# EAGLE design V4.0.1 Embutida (EAGLE 9.6.2)
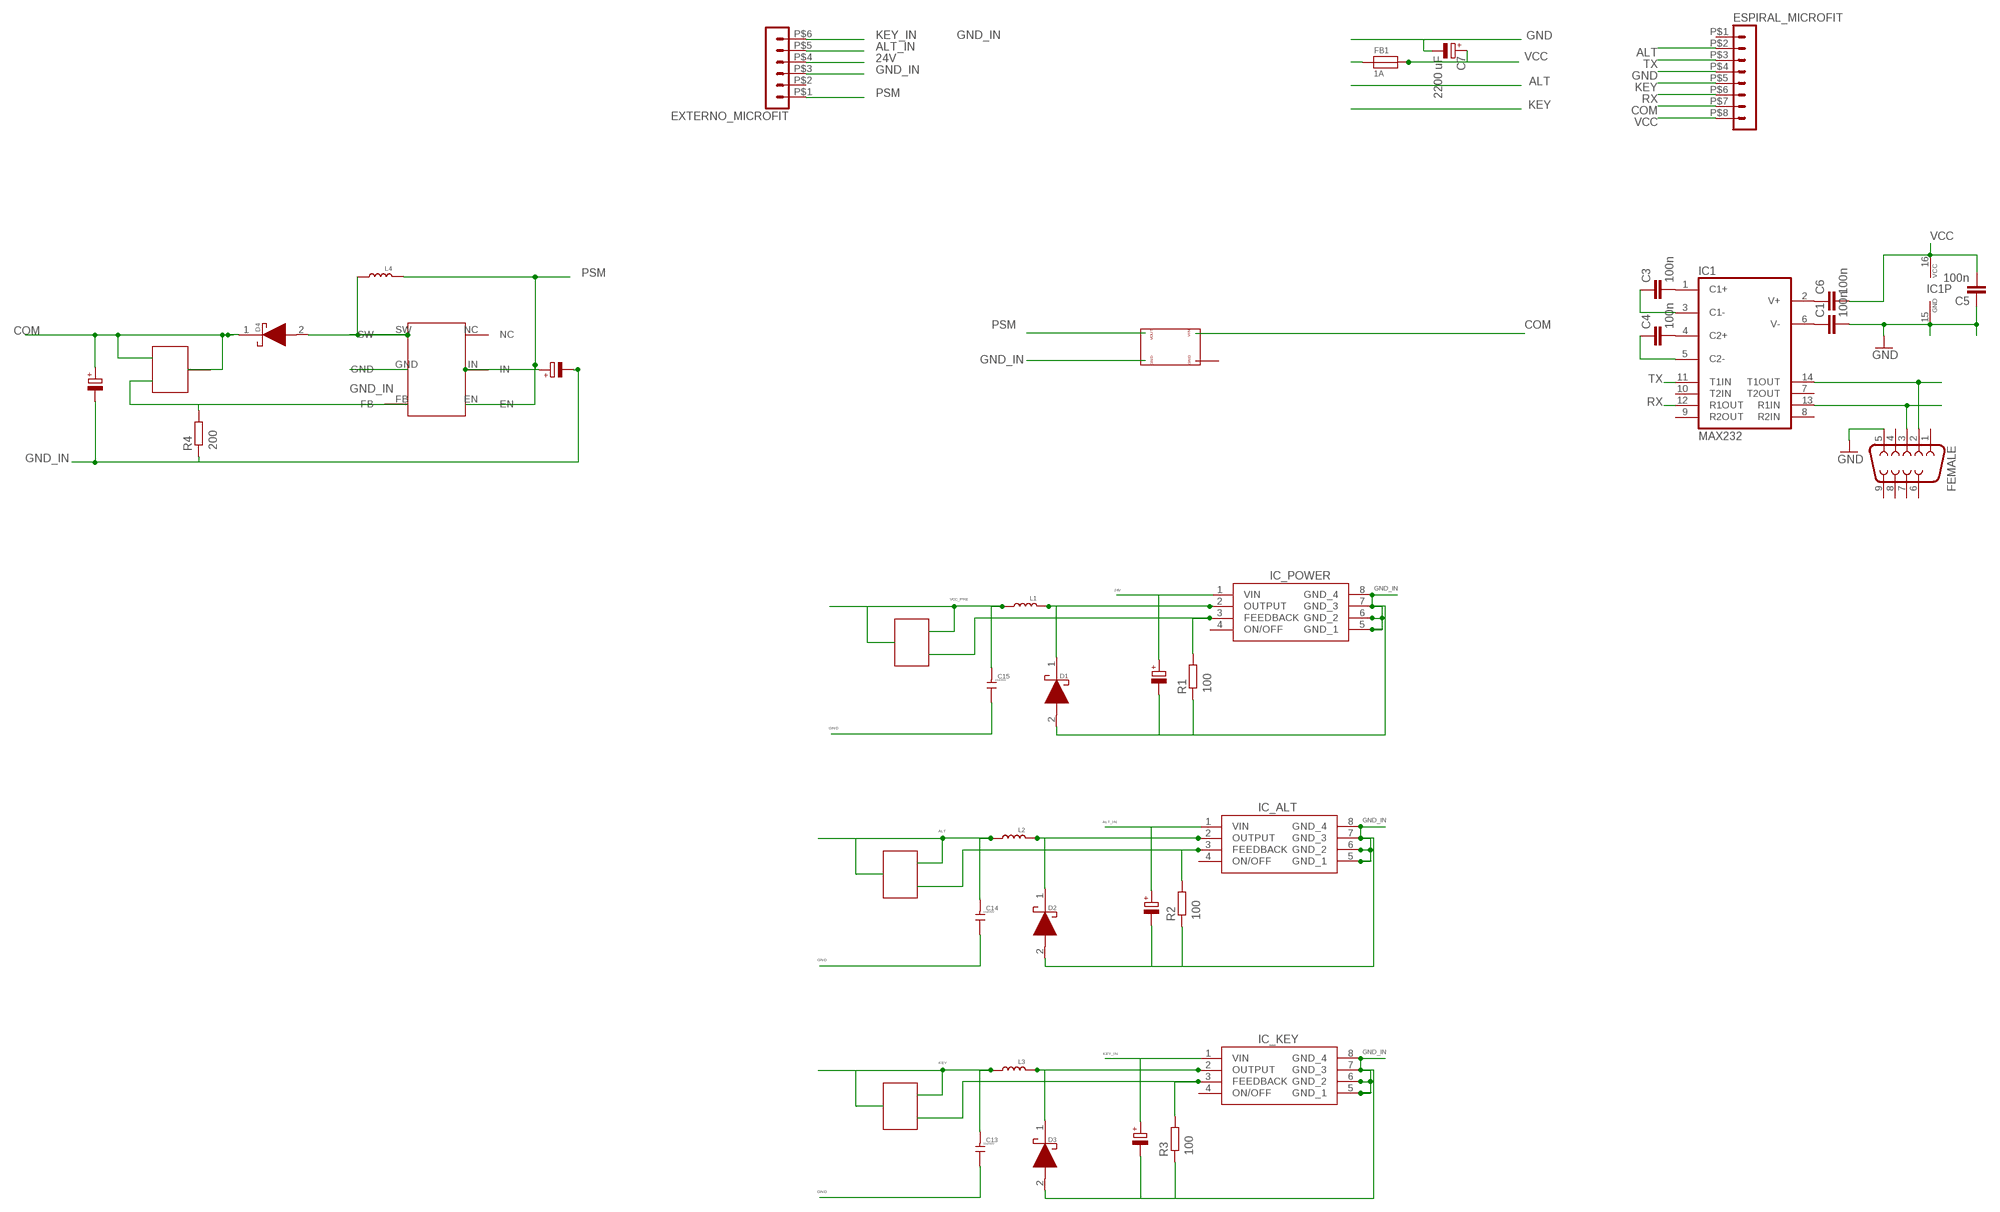
[diagram p0: schematic, sheet 1]

## Parts
C1  100n  C-EUC0805  [C0805]
C2  22uF/50v  CPOL-EUD  [PANASONIC_D]
C3  100n  C-EUC0805  [C0805]
C4  100n  C-EUC0805  [C0805]
C5  100n  C-EUC0805  [C0805]
C6  100n  C-EUC0805  [C0805]
C7  2200 uF  CPOL-EUD  [PANASONIC_D]
C8  22uF/50V  CPOL-EUD  [PANASONIC_D]
C9  22uF/50V  CPOL-EUD  [PANASONIC_D]
C13  10uF/50V  C-0805  [C0805]
C14  10uF/50V  C-0805  [C0805]
C15  10uF/50V  C-0805  [C0805]
C18  22uF/50v  CPOL-EUD  [PANASONIC_D]
C19  22uF/50v  CPOL-EUD  [PANASONIC_D]
D1  1N5819HW1-7-F  [SODFL3518X115N]
D2  1N5819HW1-7-F  [SODFL3518X115N]
D3  1N5819HW1-7-F  [SODFL3518X115N]
D4  1N5819HW1-7-F  [SODFL3518X115N]
ESPIRAL_MICROFIT  HEADER_POS8_43045-0800  [43045-0800]
EXTERNO_MICROFIT  HEADER_POS6_43045-0600  [43045-0600]
FB1  1A  FERRITE0805  [0805]
FEMALE  F09H  [F09H]
IC1  MAX232  MAX232ECWES  [SO16]
IC_ALT  XL1509-3.3E1  [SOIC127P600X175-8N]
IC_KEY  XL1509-3.3E1  [SOIC127P600X175-8N]
IC_POWER  XL1509-3.3E1  [SOIC127P600X175-8N]
IC_UP  SDB628  [SDB628]
L1  47uH  L'PIO73'  [PIO73]
L2  47uH  L'PIO73'  [PIO73]
L3  47uH  L'PIO73'  [PIO73]
L4  4.7uH  L'PIO73'  [PIO73]
R1  100  R-EU_R0805  [R0805]
R2  100  R-EU_R0805  [R0805]
R3  100  R-EU_R0805  [R0805]
R4  200  R-EU_R0805  [R0805]
STEP_UP  STEP-UP  [STEP-UP]
T1  TRIMPOT 10K  TRIMPOT  [TRIMPOT]
T2  TRIMPOT 10K  TRIMPOT  [TRIMPOT]
T3  TRIMPOT 10K  TRIMPOT  [TRIMPOT]
T4  TRIMPOT 10K  TRIMPOT  [TRIMPOT]

## Nets
24V: C2.+ EXTERNO_MICROFIT.P$4 IC_POWER.1(VIN)
ALT: C14.2 ESPIRAL_MICROFIT.P$2 L2.2 T2.VCC1 T2.VCC2
ALT_IN: C8.+ EXTERNO_MICROFIT.P$5 IC_ALT.1(VIN)
COM: C18.+ D4.1(K) ESPIRAL_MICROFIT.P$7 STEP_UP.VIN T4.VCC1 T4.VCC2
GND: C1.2 C5.1 C7.- C13.1 C14.1 C15.1 ESPIRAL_MICROFIT.P$4 FEMALE.5 IC1.15(GND)
GND_IN: C2.- C8.- C9.- C18.- C19.- D1.2(A) D2.2(A) D3.2(A) EXTERNO_MICROFIT.P$3 IC_ALT.5(GND_1) IC_ALT.6(GND_2) IC_ALT.7(GND_3) IC_ALT.8(GND_4) IC_KEY.5(GND_1) IC_KEY.6(GND_2) IC_KEY.7(GND_3) IC_KEY.8(GND_4) IC_POWER.5(GND_1) IC_POWER.6(GND_2) IC_POWER.7(GND_3) IC_POWER.8(GND_4) IC_UP.GND R1.1 R2.1 R3.1 R4.1 STEP_UP.GND_OUT
KEY: C13.2 ESPIRAL_MICROFIT.P$5 L3.2 T3.VCC1 T3.VCC2
KEY_IN: C9.+ EXTERNO_MICROFIT.P$6 IC_KEY.1(VIN)
N$1: D1.1(K) IC_POWER.2(OUTPUT) L1.1
N$2: D2.1(K) IC_ALT.2(OUTPUT) L2.1
N$3: D4.2(A) IC_UP.SW L4.2
N$4: IC_ALT.3(FEEDBACK) R2.2 T2.OUT
N$5: D3.1(K) IC_KEY.2(OUTPUT) L3.1
N$6: IC_KEY.3(FEEDBACK) R3.2 T3.OUT
N$7: IC_UP.FB R4.2 T4.OUT
N$8: IC_POWER.3(FEEDBACK) R1.2 T1.OUT
N$11: C3.2 IC1.1(C1+)
N$12: C4.2 IC1.4(C2+)
N$13: C3.1 IC1.3(C1-)
N$17: C4.1 IC1.5(C2-)
N$18: C6.1 IC1.2(V+)
N$19: C1.1 IC1.6(V-)
N$20: FEMALE.2 IC1.14(T1OUT)
N$30: FEMALE.3 IC1.13(R1IN)
PSM: C19.+ EXTERNO_MICROFIT.P$1 IC_UP.EN IC_UP.IN L4.1 STEP_UP.VOUT(OUT)
RX: ESPIRAL_MICROFIT.P$6 IC1.12(R1OUT)
TX: ESPIRAL_MICROFIT.P$3 IC1.11(T1IN)
VCC: C5.2 C6.2 C7.+ ESPIRAL_MICROFIT.P$8 FB1.2 IC1.16(VCC)
VCC_PRE: C15.2 FB1.1 L1.2 T1.VCC1 T1.VCC2
Unconnected: ESPIRAL_MICROFIT.P$1 EXTERNO_MICROFIT.P$2 FEMALE.1 FEMALE.4 FEMALE.6 FEMALE.7 FEMALE.8 FEMALE.9 IC1.7(T2OUT) IC1.8(R2IN) IC1.9(R2OUT) IC1.10(T2IN) IC_ALT.4(ON/OFF) IC_KEY.4(ON/OFF) IC_POWER.4(ON/OFF) IC_UP.NC STEP_UP.GND_IN

## Library data of the parts
C1 C3-C6 = rcl@1:C-EU: CAPACITOR, European symbol; MPN: C0805C104K8RACAUTO
C2 C8 C9 C18 C19 = rcl:CPOL-EU: POLARIZED CAPACITOR, European symbol; MPN: EEH-ZA1H220P; SPICEPREFIX: C
C7 = rcl:CPOL-EU: POLARIZED CAPACITOR, European symbol; MPN: EEV-FK1A222Q; SPICEPREFIX: C
C13-C15 = discrete:C*: Ceramic Capacitors; MPN: C2012X5R1H106K125AC
D1-D4 = 1N5819HW1-7-F:1N5819HW1-7-F: 1N5819 Schottky Diode 40V 1A SOD123F Source: Datasheet <https://www.diodes.com/assets/Datasheets/1N5819HW1.pdf>; ARROW_PART_NUMBER: 1N5819HW1-7-F; ARROW_PRICE-STOCK: https://www.arrow.com/en/products/1n5819hw1-7-f/diodes-incorporated?region=nac; DESCRIPTION: 1N5819 Schottky Diode 40V 1A SOD123F; HEIGHT: 1.15mm; MANUFACTURER_NAME: Diodes Inc.; MANUFACTURER_PART_NUMBER: 1N5819HW1-7-F; MOUSER_PART_NUMBER: 621-1N5819HW1-7-F; MOUSER_PRICE-STOCK: https://www.mouser.co.uk/ProductDetail/Diodes-Incorporated/1N5819HW1-7-F?qs=60RJRzIpcl9ACQG7Zn63jQ%3D%3D; MPN: 1N5822 SS34
ESPIRAL_MICROFIT = con-molex-micro-fit-3_0 (1):HEADER_POS8_?: Molex - Micro-Fit 3.0 Series connector, 3.00mm (0.118") pitch header, 8 positions.; MPN: 43045-0800
EXTERNO_MICROFIT = con-molex-micro-fit-3_0 (1):HEADER_POS6_?: Molex - Micro-Fit 3.0 Series connector, 3.00mm (0.118") pitch header, 6 positions.; MPN: 43045-0600
FB1 = microbuilder:FERRITE: Ferrite Bead 0603 MMZ1608B121C - 120 Ohm, 600mA Ferrite Chip - Digikey: 445-2164-1-ND BK1608HW121-T - 120 Ohm, 600mA Ferrite Chip - Digikey: 587-1876-2-ND 0805 HZ0805B272R-10 - 2.7K Ohm @ 100MHz, 200mA 0.8 Ohm DC Resistance - Digikey: 240-2504-1-ND (see also Murata BLM21BD272SN1L); MPN: BLM21AG121SN1D
FEMALE = con-subd:F09: SUB-D; MPN: FEMALE DR9; OC_FARNELL: unknown; OC_NEWARK: unknown
IC1 = maxim-6b:MAX232ECWE: RS232 TRANSEIVER; MPN: MAX3232CSE+
IC_ALT IC_KEY IC_POWER = XL1509-3.3E1:XL1509-3.3E1: 40V 2A SOP-8_150mil DC-DC Converters RoHS Source: Datasheet <https://datasheet.lcsc.com/szlcsc/XLSEMI-XL1509-3-3E1_C74193.pdf>; DESCRIPTION: 40V 2A SOP-8_150mil DC-DC Converters RoHS; HEIGHT: 1.75mm; MANUFACTURER_NAME: XLSEMI; MANUFACTURER_PART_NUMBER: XL1509-3.3E1; MPN: XL1509-ADJE1
IC_UP = SDB628:SDB628; MPN: SDB628
L1-L3 = discrete:L*; MPN: SDE0604A-470M
L4 = discrete:L*; MPN: DR74-4R7-R
R1-R3 = rcl:R-EU_: RESISTOR, European symbol; MPN: RA73F2A100RBTDF; SPICEPREFIX: R
R4 = rcl:R-EU_: RESISTOR, European symbol; MPN: CRCW0805200RJNEAIF; SPICEPREFIX: R
STEP_UP = Step Up:STEP-UP; MPN: SX1308
T1-T4 = TRIMPOT:TRIMPOT; MPN: EVM3ESX50B14

## Module LDR
Ports: 

### Library data of the parts

## Net classes
1 New Class: width 0.5 mm, drill 1 mm

## Board
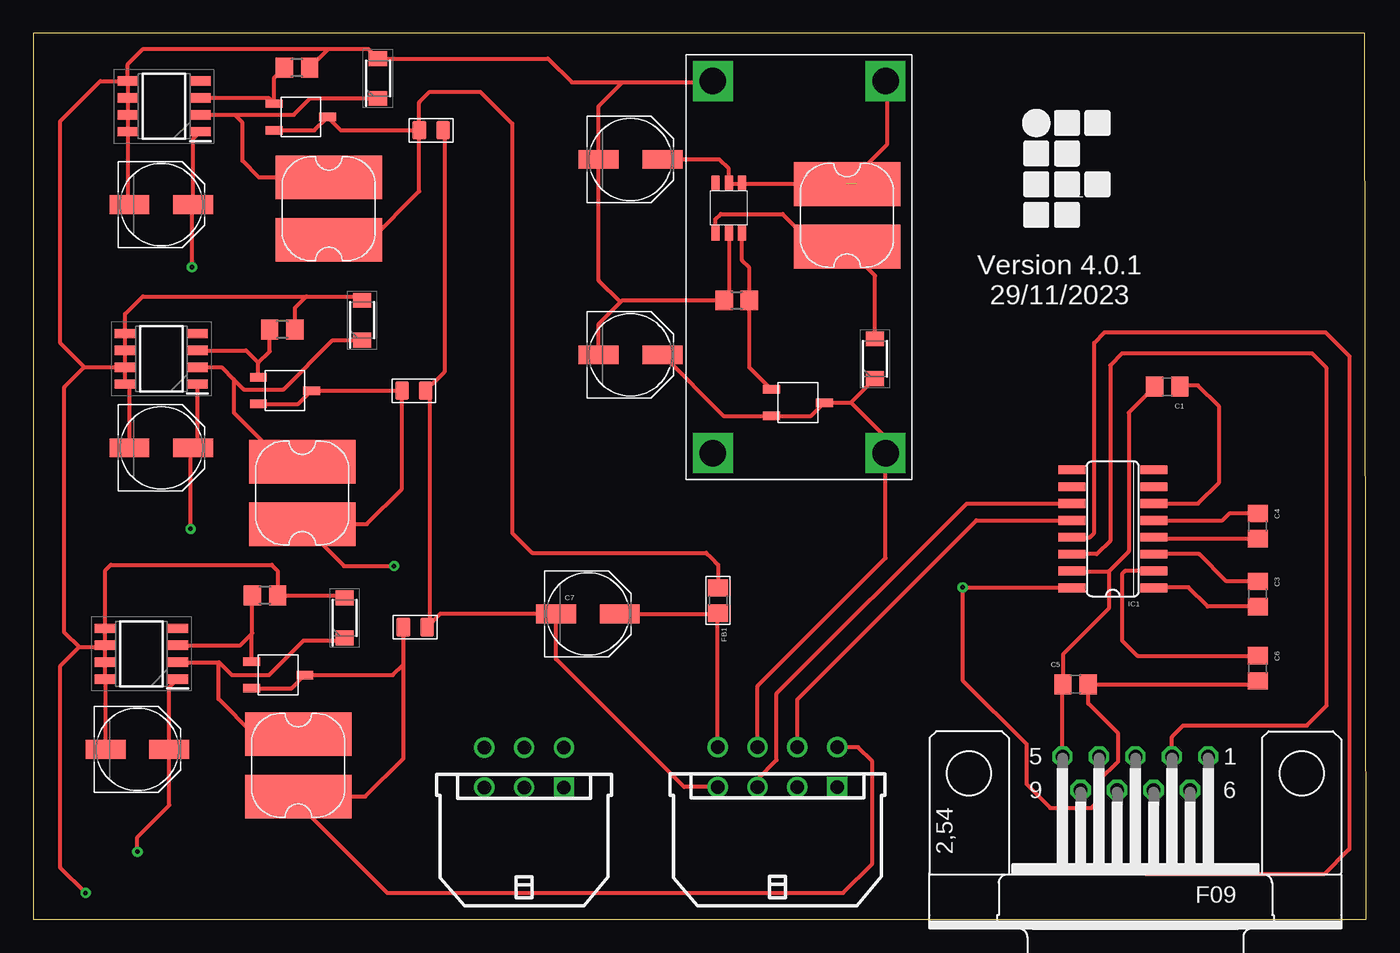
[diagram p1: board, top side]
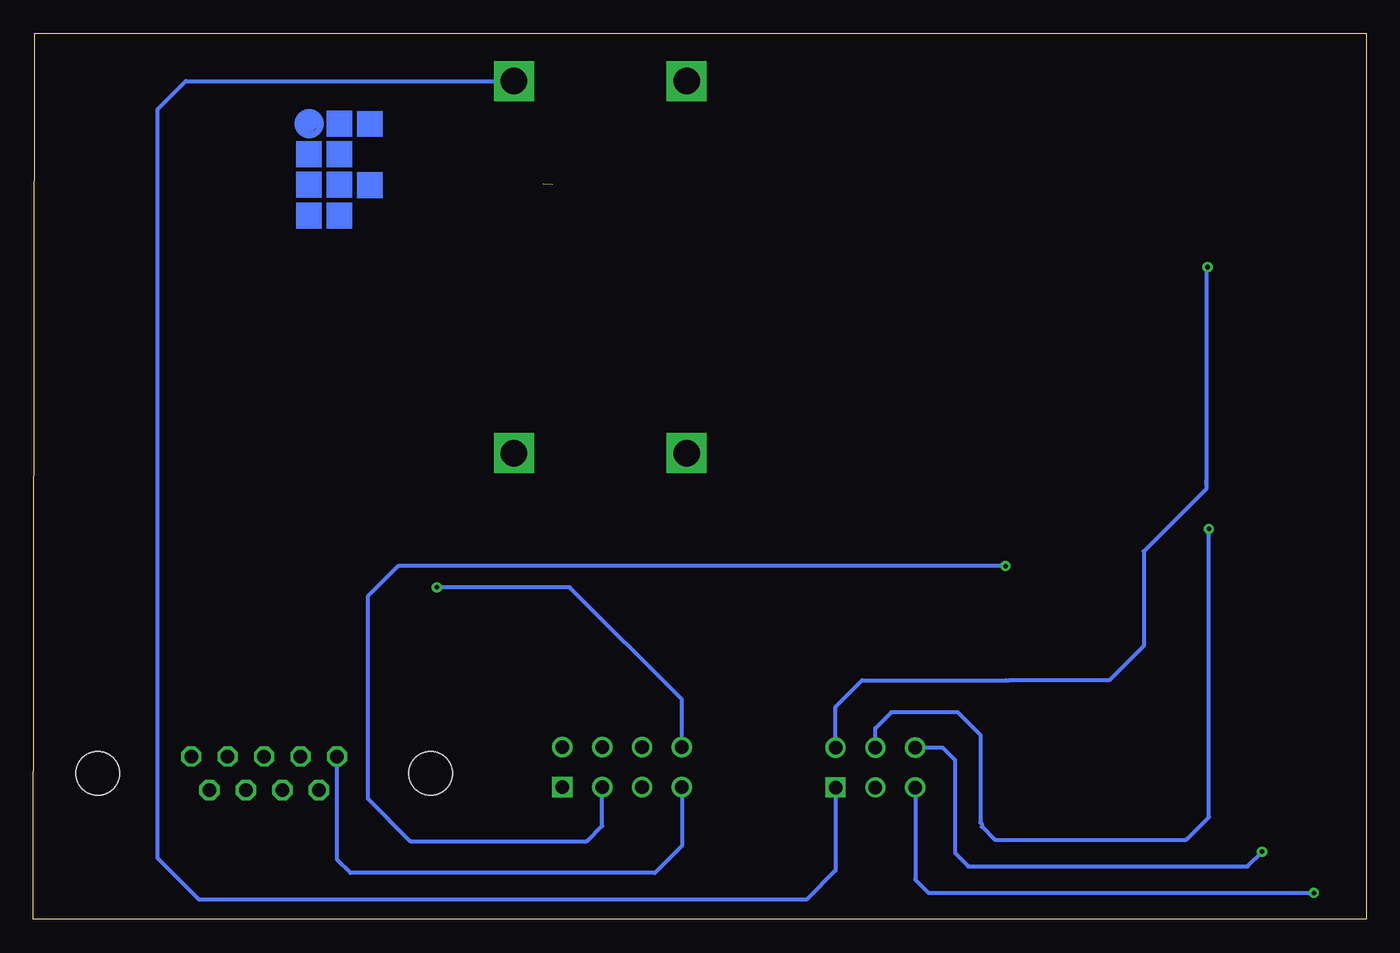
[diagram p2: board, bottom side, seen from below]

Size 100.32 x 66.7 mm. Coordinates in mm from the lower left corner, seen from the top.
Outline: 0,0 100.32,0 100.2,66.7 0,66.7 0,0
Copper layers (1*16): Top 0.035mm / dielectric 1.5mm / Bottom 0.035mm
Design rules "default *": minimum track width 6mil, minimum drill 0.35mm, track to track 6mil, track to pad 6mil, pad to pad 6mil, via to via 6mil, smd to smd 6mil, copper to edge 40mil, drill to drill 6mil, minimum pad ring 10mil, minimum via ring 8mil, stop-mask expansion 4mil, vias tented up to drill 0mil, thermal gap 10mil

### Footprints (pad centres in the part's own frame; a part is rotated, then mirrored left to right if it is on the bottom)
C0805 = smd 1.3 x 1.5: 1 -0.95,0; 2 0.95,0
PANASONIC_D = smd 3 x 1.4: + 2.4,0; - -2.4,0
C0805' = smd 1.016 x 1.397: 1 -0.889,0; 2 0.889,0
SODFL3518X115N = smd 1.12 x 1.37: 1 -1.5,0; 2 1.5,0
43045-0800 = drill 1.02 square: P$1 4.5,4.32 | drill 1.02: P$2 1.5,4.32; P$3 -1.5,4.32; P$4 -4.5,4.32; P$5 4.5,7.32; P$6 1.5,7.32; P$7 -1.5,7.32; P$8 -4.5,7.32
43045-0600 = drill 1.02 square: P$1 3,4.32 | drill 1.02: P$2 0,4.32; P$3 -3,4.32; P$4 3,7.32; P$5 0,7.32; P$6 -3,7.32
0805 = smd 1.3 x 1.5: 1 -0.95,0; 2 0.95,0
F09H = drill 1.016 octagon: 1 -5.486,-1.27; 2 -2.743,-1.27; 3 0,-1.27; 4 2.743,-1.27; 5 5.486,-1.27; 6 -4.115,1.27; 7 -1.372,1.27; 8 1.372,1.27; 9 4.115,1.27 | hole 3.302: -12.522,0; 12.522,0
SO16 = smd 0.66 x 2.032: 1 -4.445,-3.073; 2 -3.175,-3.073; 3 -1.905,-3.073; 4 -0.635,-3.073; 5 0.635,-3.073; 6 1.905,-3.073; 7 3.175,-3.073; 8 4.445,-3.073; 9 4.445,3.073; 10 3.175,3.073; 11 1.905,3.073; 12 0.635,3.073; 13 -0.635,3.073; 14 -1.905,3.073; 15 -3.175,3.073; 16 -4.445,3.073
SOIC127P600X175-8N = smd 1.55 x 0.7: 1 -2.725,1.905; 2 -2.725,0.635; 3 -2.725,-0.635; 4 -2.725,-1.905; 5 2.725,-1.905; 6 2.725,-0.635; 7 2.725,0.635; 8 2.725,1.905
SDB628 = smd 0.6 x 1.2: EN -1.6,4.4; FB -1.6,0.7; GND -2.6,0.7; IN -2.6,4.4; NC -3.6,4.4; SW -3.6,0.7
PIO73 = smd 8 x 3.3: 1 0,2.35; 2 0,-2.35
R0805 = smd 1.3 x 1.5: 1 -0.95,0; 2 0.95,0
STEP-UP = drill 2 square: GND_IN -15,2; GND_OUT -15,30; VIN -2,2; VOUT -2,30
TRIMPOT = smd 1.27 x 0.635: OUT 0.5,0.5; VCC1 -3.5,1.5; VCC2 0.5,2.5

### Placement (x,y rotation side)
C1  85.34,40.09 180 top
C2  9.64,53.79 0 top
C3  92.14,24.49 270 top
C4  92.14,29.59 270 top
C5  78.44,17.69 0 top
C6  92.14,18.89 270 top
C7  41.74,22.99 0 top
C8  9.64,35.49 0 top
C9  7.84,12.79 0 top
C13  10uF/50V  [C0805']  28.74,21.99 180 top
C14  10uF/50V  [C0805']  28.64,39.79 180 top
C15  10uF/50V  [C0805']  29.94,59.39 180 top
C18  44.94,42.49 0 top
C19  44.94,57.19 0 top
D1  25.94,63.29 90 top
D2  24.74,45.09 90 top
D3  23.44,22.69 90 top
D4  63.34,42.19 90 top
ESPIRAL_MICROFIT  56.01,5.64 0 top
EXTERNO_MICROFIT  36.94,5.62 0 top
FB1  51.54,23.99 270 top
FEMALE  82.94,10.99 180 top
IC1  81.24,29.39 90 top
IC_ALT  9.64,42.19 180 top
IC_KEY  8.14,19.99 180 top
IC_POWER  9.84,61.19 180 top
IC_UP  54.94,50.99 0 top
L1  22.24,53.49 0 top
L2  20.24,32.09 0 top
L3  19.94,11.59 0 top
L4  61.24,52.99 0 top
R1  19.84,64.09 180 top
R2  18.74,44.39 180 top
R3  17.44,24.39 180 top
R4  52.94,46.59 0 top
STEP_UP  66.14,33.09 0 top
T1  18.64,61.89 180 top
T2  17.44,41.29 180 top
T3  16.94,19.89 180 top
T4  56.04,40.39 180 top

### Tracks (layer width: path | path; a pad name or v marks a point on that pad's centre or on a via)
24V  (via drill 0.35)
  Top 0.305: IC_POWER.1 12.04,58.76 C2.+ 11.94,53.69 v11.94,49.09
  Bottom 0.305: EXTERNO_MICROFIT.P$4 39.94,15.99 37.94,17.99 27.14,17.99 26.84,17.99 19.34,17.99 16.74,20.59 16.74,27.69 12.04,32.39 12.04,32.79 12.04,32.99 12.04,48.99 v11.94,49.09
ALT  (via drill 0.35)
  Top 0.305: T2.VCC2 19.94,38.79 T2.VCC1 C14.2 27.75,32.41 25.09,29.74 L2.2 23.39,26.59 v27.14,26.59
  Bottom 0.305: v27.14,26.59 72.84,26.59 75.14,24.29 75.14,9.09 71.94,5.89 58.64,5.89 57.51,7.03 ESPIRAL_MICROFIT.P$2
ALT_IN  (via drill 0.35)
  Top 0.305: IC_ALT.1 12.37,35.82 C8.+ 11.84,35.29 v11.84,29.39
  Bottom 0.305: EXTERNO_MICROFIT.P$5 36.94,14.39 35.74,15.59 30.74,15.59 29.04,13.89 29.04,7.29 28.94,7.19 28.94,6.99 27.94,5.99 13.54,5.99 11.84,7.69 v11.84,29.39
COM
  Top 0.305: ESPIRAL_MICROFIT.P$7 54.51,17.56 64.14,27.19 STEP_UP.VIN 64.14,36.29 61.54,38.89 | 61.54,38.89 D4.1 | 61.54,38.89 T4.VCC1 58.54,37.89 55.64,37.89 T4.VCC2 51.94,37.89 C18.+
GND
  Top 0.305: ESPIRAL_MICROFIT.P$4 48.98,9.96 39.34,19.59 C7.- 30.63,22.99 C13.1 29.83,22.19 29.83,39.49 C14.1 30.94,41.21 30.94,59.28 C15.1 | C1.2 82.44,38.14 82.44,27.69 80.94,26.19 | IC1.15 78.2,26.19 80.94,26.19 | 80.94,26.19 80.94,23.39 77.49,19.94 77.49,17.99 | 77.49,17.99 C5.1 | FEMALE.5 77.46,17.96 77.49,17.99
  Bottom 0.305: ESPIRAL_MICROFIT.P$4 51.51,5.53 53.54,3.49 76.44,3.49 77.44,4.49 77.44,12.25 FEMALE.5
GND_IN  (via drill 0.35)
  Top 0.305: STEP_UP.GND_OUT 51.04,62.99 44.34,62.99 | v3.94,1.99 2.04,3.89 2.04,19.09 3.44,20.49 | C9.- 5.44,18.06 IC_KEY.8 IC_KEY.7 5.42,20.49 | 5.42,20.49 IC_KEY.6 IC_KEY.5 | IC_KEY.5 | 23.04,24.59 D3.2 23.24,24.39 R3.1 18.39,26.24 17.94,26.69 5.84,26.69 5.42,26.27 IC_KEY.5 | C8.- 7.24,39.96 IC_ALT.8 IC_ALT.7 | IC_ALT.7 IC_ALT.6 IC_ALT.5 6.92,45.57 8.24,46.89 20.54,46.89 | 20.54,46.89 24.44,46.89 D2.2 | 3.44,20.49 5.42,20.49 | 3.44,20.49 2.34,21.59 2.34,40.05 3.85,41.56 | 3.85,41.56 IC_ALT.7 | 3.85,41.56 2.04,43.37 2.04,60.09 5.05,63.1 IC_POWER.5 | IC_POWER.5 IC_POWER.6 IC_POWER.7 IC_POWER.8 7.12,53.92 C2.- | IC_POWER.5 7.12,64.37 8.28,65.53 22.23,65.53 | 44.34,62.99 40.54,62.99 38.74,64.79 D1.2 25.21,65.53 22.24,65.53 22.23,65.53 | IC_UP.GND 52.34,46.94 R4.1 44.34,46.59 44.19,46.44 | 44.34,62.99 42.54,61.19 C19.- 42.54,48.09 44.19,46.44 | C18.- 42.54,44.79 44.19,46.44 | R2.1 19.69,46.04 20.54,46.89 | R1.1 22.23,65.53
  Bottom 0.305: EXTERNO_MICROFIT.P$3 33.94,2.99 32.94,1.99 v3.94,1.99
KEY
  Top 0.305: ESPIRAL_MICROFIT.P$5 62.08,12.96 63.14,11.89 63.14,4.19 60.94,1.99 26.64,1.99 19.94,8.69 L3.2 24.99,9.24 27.85,12.11 27.85,19.19 | 27.85,19.19 C13.2 | T3.VCC2 19.44,17.39 T3.VCC1 27.05,18.39 27.85,19.19
KEY_IN  (via drill 0.35)
  Top 0.305: v7.84,5.09 7.84,6.19 10.24,8.59 C9.+ 10.24,17.46 IC_KEY.1
  Bottom 0.305: EXTERNO_MICROFIT.P$6 31.89,12.94 30.94,11.99 30.94,4.99 29.94,3.99 8.94,3.99 v7.84,5.09
N$1
  Top 0.305: IC_POWER.2 15.14,60.56 | 15.14,60.56 19.61,60.56 20.84,61.79 D1.1 | L1.1 16.99,55.84 15.74,57.09 15.74,59.96 15.14,60.56
N$2
  Top 0.305: IC_ALT.2 14.18,41.56 15.09,40.64 | 15.09,40.64 15.84,39.89 18.84,39.89 22.54,43.59 D2.1 | 15.09,40.64 15.09,38.14 18.79,34.44 L2.1
N$3
  Top 0.305: IC_UP.SW 51.34,52.69 51.74,53.09 56.39,53.09 58.84,50.64 61.14,50.64 | 61.14,50.64 L4.2 | D4.2 63.34,48.44 61.14,50.64
N$4
  Top 0.305: T2.OUT 16.94,41.89 | IC_ALT.3 16.01,42.83 16.94,41.89 | R2.2 17.79,42.74 16.94,41.89
N$5
  Top 0.305: D3.1 23.44,20.99 20.34,20.99 17.74,18.39 14.94,18.39 13.98,19.36 | IC_KEY.2 13.98,19.36 | L3.1 16.59,13.94 13.94,16.59 13.94,19.32 13.98,19.36
N$6
  Top 0.305: T3.OUT 16.44,21.49 | IC_KEY.3 15.58,20.63 16.44,21.49 | 16.44,21.49 16.49,21.54 R3.2
N$7
  Top 0.305: IC_UP.FB 53.34,49.59 53.89,49.04 R4.2 53.89,41.54 T4.OUT
N$8
  Top 0.305: IC_POWER.3 17.71,61.83 T1.OUT 18.14,63.34 R1.2
N$11
  Top 0.305: C3.2 88.39,23.54 86.94,24.99 84.36,24.99 IC1.1
N$12
  Top 0.305: C4.2 84.43,28.64 IC1.4
N$13
  Top 0.305: C3.1 89.79,25.44 87.75,27.49 IC1.3
N$17
  Top 0.305: C4.1 89.99,30.54 89.44,29.99 84.35,29.99 IC1.5
N$18
  Top 0.305: IC1.2 82.17,26.22 81.94,25.99 81.94,20.99 83.09,19.84 C6.1
N$19
  Top 0.305: IC1.6 87.65,31.3 89.24,32.89 89.24,38.59 87.64,40.19 86.39,40.19 C1.1
N$20
  Top 0.305: FEMALE.2 85.69,13.74 86.54,14.59 95.84,14.59 97.34,16.09 97.34,41.49 96.24,42.59 81.94,42.59 81.04,41.69 81.04,28.49 80.04,27.49 IC1.14
N$30
  Top 0.305: IC1.13 79.51,28.76 79.84,29.09 79.84,43.39 80.64,44.19 97.24,44.19 99.07,42.36 99.07,5.33 99.03,5.28 98.97,5.23 97.14,3.39 83.74,3.39 82.94,4.19 FEMALE.3
PSM  (1 unrouted)
  Top 0.305: 61.34,55.39 IC_UP.EN IC_UP.IN 52.34,56.49 51.64,57.19 C19.+ | 61.34,55.39 61.94,55.39 | STEP_UP.VOUT 64.24,62.99 64.24,58.29 61.34,55.39
  Bottom 0.305: EXTERNO_MICROFIT.P$1 39.94,3.69 42.14,1.49 87.84,1.49 90.94,4.59 90.94,60.99 88.84,63.09 STEP_UP.VOUT
RX
  Top 0.305: ESPIRAL_MICROFIT.P$6 57.51,16.56 70.98,30.03 IC1.12
TX
  Top 0.305: ESPIRAL_MICROFIT.P$3 54.51,10.56 55.94,11.99 55.94,16.99 70.25,31.3 IC1.11
VCC  (via drill 0.35)
  Top 0.305: ESPIRAL_MICROFIT.P$8 51.51,22.89 | 51.51,22.89 51.51,23.01 | 51.51,23.01 FB1.2 | 51.47,23.04 51.51,23.01 | IC1.16 78.13,24.99 v69.94,24.99 69.94,17.99 74.74,13.19 74.74,10.19 76.54,8.39 79.64,8.39 80.24,8.99 80.24,10.49 81.64,11.89 81.64,13.99 79.39,16.24 C5.2 | 91.69,17.49 91.89,17.69 | C5.2 91.89,17.69 | 91.89,17.69 C6.2 | 79.44,17.64 C5.2 | C7.+ 51.41,22.99 51.51,22.89
  Bottom 0.305: ESPIRAL_MICROFIT.P$8 51.51,16.56 59.94,24.99 v69.94,24.99
VCC_PRE
  Top 0.305: T1.VCC2 21.14,59.39 T1.VCC1 23.14,59.39 C15.2 | L1.2 25.39,51.14 29.05,54.81 C15.2 | C15.2 29.05,61.51 29.84,62.29 33.64,62.29 36.04,59.89 36.04,29.09 37.54,27.59 50.64,27.59 50.99,27.24 | FB1.1 51.54,26.69 50.99,27.24 | 50.99,27.24
(copper drawn outside any net)
  shapes: Bottom area x9, Bottom circle x3

### Text on the board
tNames: Version 4.0.1 / 29/11/2023